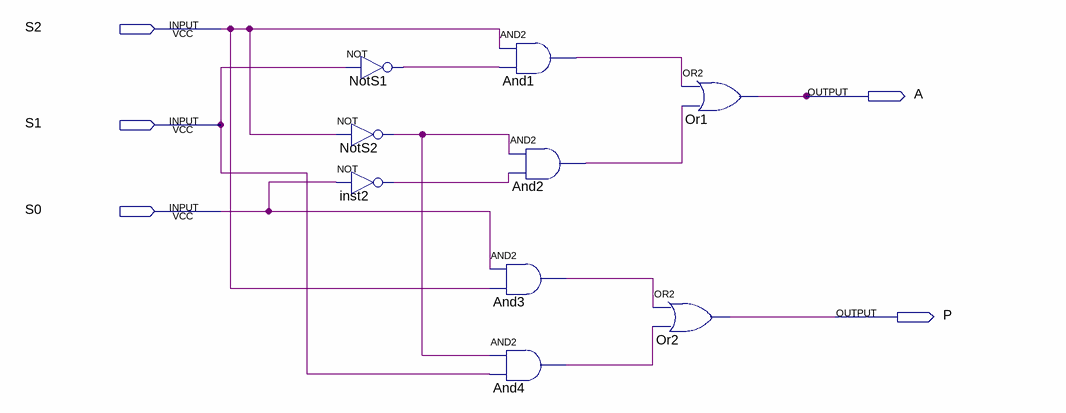
[diagram p0: schematic sheet]
// Quartus schematic Lab5.bdf as structural Verilog: 9 symbols, 5 pins
module Lab5 (
  input  S2,
  input  S1,
  input  S0,
  output A,
  output P
);

  wire And1_out, And2_out, And3_out, And4_out, inst2_out, NotS1_out, NotS2_out;

  not NotS1 (NotS1_out, S1);
  not NotS2 (NotS2_out, S2);
  not inst2 (inst2_out, S0);
  and And1 (And1_out, S2, NotS1_out);
  and And2 (And2_out, NotS2_out, inst2_out);
  and And3 (And3_out, S0, S2);
  and And4 (And4_out, NotS2_out, S1);
  or Or1 (A, And1_out, And2_out);
  or Or2 (P, And3_out, And4_out);
endmodule
